# Altium schematic sheet mcu2.SchDoc
size A4
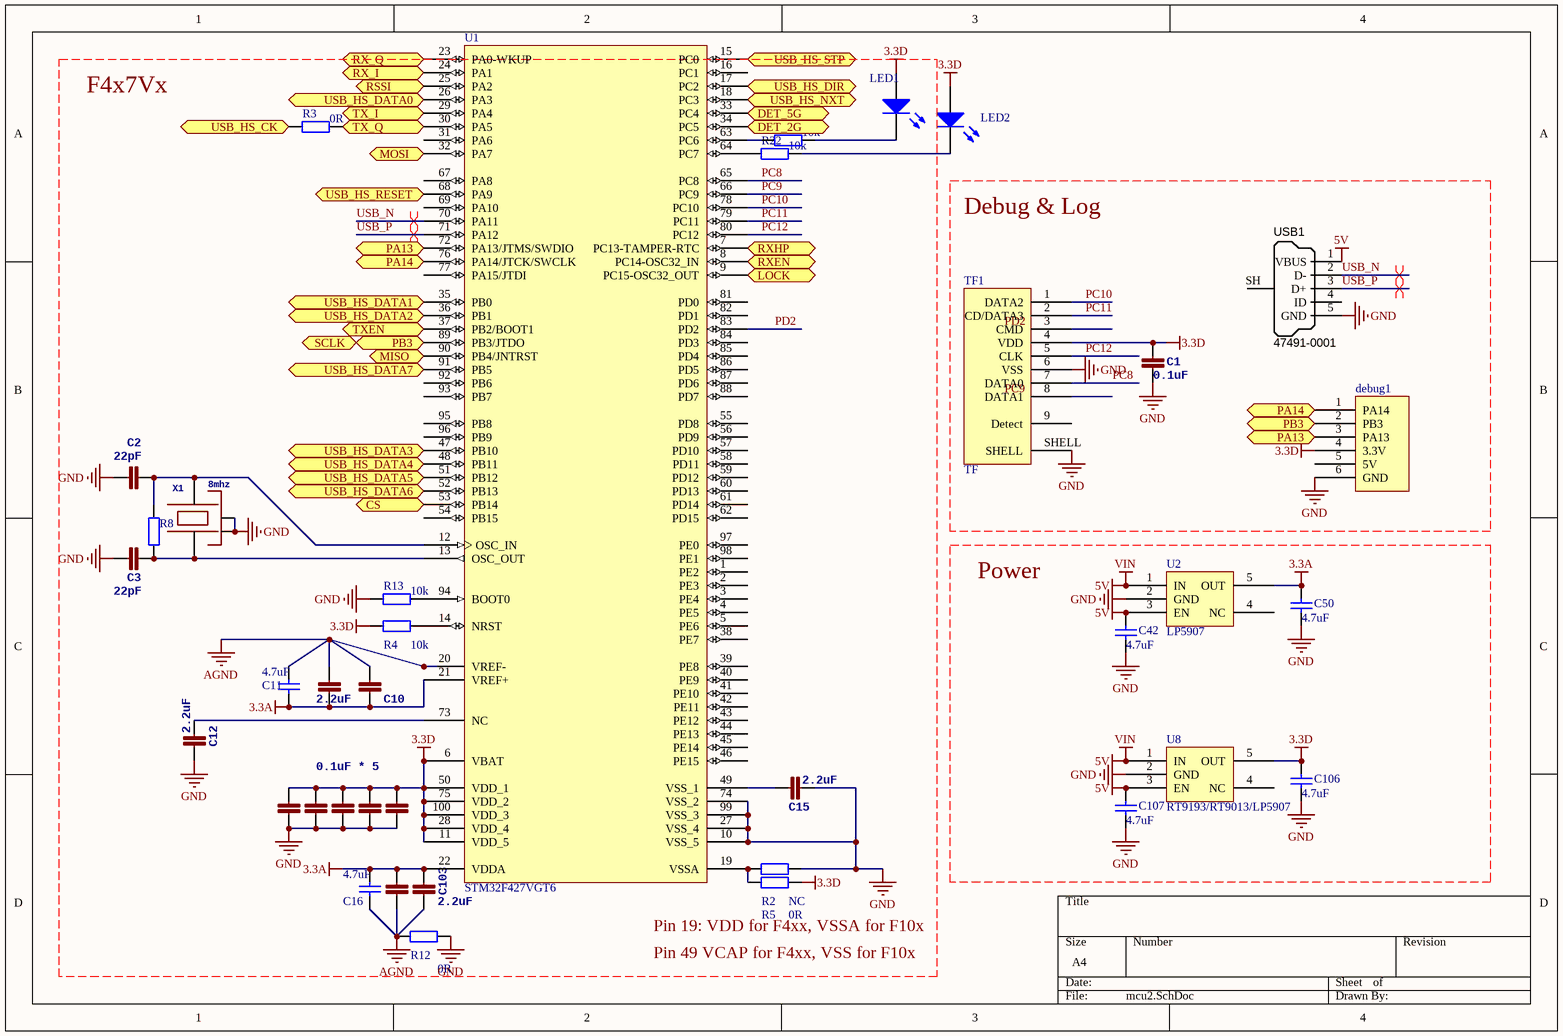
[diagram p0: mcu2.SchDoc]

## Parts
C1  0.1uF  [0402]
C2  22pF  [0402]
C3  22pF  [0402]
C4  0.1uF * 5  [0402]
C5  1n  [0402]  (value not drawn)
C6  1n  [0402]  (value not drawn)
C7  1n  [0402]  (value not drawn)
C10  2.2uF  [0603]
C11  4.7uF  [0805]
C12  2.2uF  [0603]
C13  1n  [0402]  (value not drawn)
C14  1n  [0402]  (value not drawn)
C15  2.2uF  [0603]
C16  4.7uF  [0805]
C42  4.7uF  [0603]
C50  4.7uF  [0603]
C102  1n  [0402]  (value not drawn)
C103  2.2uF  [0603]
C106  4.7uF  [0603]
C107  4.7uF  [0603]
debug1  debug  [WFRSM125]  (value not drawn)
LED1  LED0  [0603]  (value not drawn)
LED2  LED0  [0603]  (value not drawn)
R2  0R  [0402]
R3  0R  [0402]
R4  10k  [0402]
R5  NC  [0402]
R8  (no value)  [0402]
R12  0R  [0402]
R13  10k  [0402]
R21  10k  [0402]
R22  10k  [0402]
TF1  TF  [TF]
U1  STM32F427VGT6  [LQFP100_N]
U2  LP5907  [SOT23-5]
U8  RT9193/RT9013/LP5907  [SOT23-5]
USB1  Manufacturer Part Number 1: 47491-0001  [MICRO-YZX]  (hidden comment: USB Micro Type B)
X1  8mhz  [OSCILLATOR-3.2X2.5]

## Ports
CS, DET_2G, DET_5G, LOCK, MISO, MOSI, PA13, PA14, PB3, RSSI, RX_I, RX_Q, RXEN, RXHP, SCLK, TX_I, TX_Q, TXEN, USB_HS_CK, USB_HS_DATA0, USB_HS_DATA1, USB_HS_DATA2, USB_HS_DATA3, USB_HS_DATA4, USB_HS_DATA5, USB_HS_DATA6, USB_HS_DATA7, USB_HS_DIR, USB_HS_NXT, USB_HS_RESET, USB_HS_STP

## Nets
3.3A: C7.1 C10.1 C11.2 C16.1 C50.2 C102.2 C103.2 U1.21(VREF+) U1.22(VDDA) U2.5(OUT)
3.3D: C1.2 C4.2 C5.2 C6.2 C13.2 C14.2 C106.2 debug1.4(3.3V) LED1.1(A) LED2.1(A) R2.1 R4.2 TF1.4(VDD) U1.6(VBAT) U1.11(VDD_5) U1.28(VDD_4) U1.50(VDD_1) U1.75(VDD_2) U1.100(VDD_3) U8.5(OUT)
5V: C42.2 C107.2 U2.1(IN) U2.3(EN) U8.1(IN) U8.3(EN) USB1.1(VBUS)  [also labelled VIN]
AGND: C7.2 C10.2 C11.1 C16.2 C102.1 C103.1 R12.2 U1.20(VREF-)
GND: C1.1 C2.2 C3.2 C4.1 C5.1 C6.1 C12.1 C13.1 C14.1 C15.2 C42.1 C50.1 C106.1 C107.1 debug1.6(GND) R5.1 R12.1 R13.1 TF1.6(VSS) TF1.SHELL U1.10(VSS_5) U1.27(VSS_4) U1.74(VSS_2) U1.99(VSS_3) U2.2(GND) U8.2(GND) USB1.5(GND) X1.2(NC_2) X1.4(NC_4)
CS: U1.53(PB14) ; port CS
DET_2G: U1.34(PC5) ; port DET_2G
DET_5G: U1.33(PC4) ; port DET_5G
LOCK: U1.9(PC15-OSC32_OUT) ; port LOCK
MISO: U1.90(PB4/JNTRST) ; port MISO
MOSI: U1.32(PA7) ; port MOSI
PA13: debug1.3(PA13) U1.72(PA13/JTMS/SWDIO) ; port PA13
PA14: debug1.1(PA14) U1.76(PA14/JTCK/SWCLK) ; port PA14
PB3: debug1.2(PB3) U1.89(PB3/JTDO) ; port SCLK, port PB3
PC8: TF1.7(DATA0) U1.65(PC8)
PC9: U1.66(PC9)
PC10: TF1.1(DATA2) U1.78(PC10)
PC11: TF1.2(CD/DATA3) U1.79(PC11)
PC12: TF1.5(CLK) U1.80(PC12)
PD2: U1.83(PD2)
RSSI: U1.25(PA2) ; port RSSI
RX_I: U1.24(PA1) ; port RX_I
RX_Q: U1.23(PA0-WKUP) ; port RX_Q
RXEN: U1.8(PC14-OSC32_IN) ; port RXEN
RXHP: U1.7(PC13-TAMPER-RTC) ; port RXHP
TX_I: U1.29(PA4) ; port TX_I
TX_Q: R3.2 U1.30(PA5) ; port TX_Q
TXEN: U1.37(PB2/BOOT1) ; port TXEN
USB_HS_CK: R3.1 ; port USB_HS_CK
USB_HS_DATA0: U1.26(PA3) ; port USB_HS_DATA0
USB_HS_DATA1: U1.35(PB0) ; port USB_HS_DATA1
USB_HS_DATA2: U1.36(PB1) ; port USB_HS_DATA2
USB_HS_DATA3: U1.47(PB10) ; port USB_HS_DATA3
USB_HS_DATA4: U1.48(PB11) ; port USB_HS_DATA4
USB_HS_DATA5: U1.51(PB12) ; port USB_HS_DATA5
USB_HS_DATA6: U1.52(PB13) ; port USB_HS_DATA6
USB_HS_DATA7: U1.91(PB5) ; port USB_HS_DATA7
USB_HS_DIR: U1.17(PC2) ; port USB_HS_DIR
USB_HS_NXT: U1.18(PC3) ; port USB_HS_NXT
USB_HS_RESET: U1.68(PA9) ; port USB_HS_RESET
USB_HS_STP: U1.15(PC0) ; port USB_HS_STP
USB_N: U1.70(PA11) USB1.2(D-)
USB_P: U1.71(PA12) USB1.3(D+)
NetC2_1: C2.1 R8.2 U1.12(OSC_IN) X1.3
NetC3_1: C3.1 R8.1 U1.13(OSC_OUT) X1.1
NetC12_2: C12.2 U1.73(NC)
NetC15_1: C15.1 U1.49(VSS_1)
NetLED1_2: LED1.2(K) R21.2
NetLED2_2: LED2.2(K) R22.2
NetR2_2: R2.2 R5.2 U1.19(VSSA)
NetR4_1: R4.1 U1.14(NRST)
NetR13_2: R13.2 U1.94(BOOT0)
NetR21_1: R21.1 U1.63(PC6)
NetR22_1: R22.1 U1.64(PC7)

Not connected (* = marked no-connect by the designer): debug1 5(5V); TF1 3(CMD) 8(DATA1) 9(Detect); U1 1(PE2) 2(PE3) 3(PE4) 4(PE5) 5(PE6) 16(PC1) 31(PA6) 38(PE7) 39(PE8) 40(PE9) 41(PE10) 42(PE11) 43(PE12) 44(PE13) 45(PE14) 46(PE15) 54(PB15) 55(PD8) 56(PD9) 57(PD10) 58(PD11) 59(PD12) 60(PD13) 61(PD14) 62(PD15) 67(PA8) 69(PA10) 77(PA15/JTDI) 81(PD0) 82(PD1) 84(PD3) 85(PD4) 86(PD5) 87(PD6) 88(PD7) 92(PB6) 93(PB7) 95(PB8) 96(PB9) 97(PE0) 98(PE1); U2 4(NC); U8 4(NC); USB1 4(ID) SH(Shell)

## Layout directives
differential pair: USB_N, USB_P

## Notes on the sheet
- F4x7Vx
- Debug & Log
- Power
- Pin 19: VDD for F4xx, VSSA for F10x
- Pin 49 VCAP for F4xx, VSS for F10x
- Labels drawn without touching a wire or pin: PC9, PD2

## Library data of the parts
C1-C7 C10 C12-C15 C102 C103 = CAP0402-CAP: <b>Capacitor</b> / Standard 0603 ceramic capacitor, and 0.1" leaded capacitor.; PARTNO: CC0402ZRY5V7BB104
C11 C16 C42 C50 C106 C107 = Cap: Capacitor; Published: 8-Jun-2000; LatestRevisionDate: 17-Jul-2002; LatestRevisionNote: Re-released for DXP Platform.; PackageReference: RAD-0.3; Publisher: Altium Limited; PackageDescription: Radial Cap, Thru-Hole; 2 Leads; 0.3 in Pin Spacing
LED1 LED2 = LED0: Typical INFRARED GaAs LED; Published: 8-Jun-2000; LatestRevisionDate: 08-Jul-2005; LatestRevisionNote: Mech Layer 1 removed.; PackageReference: LED-0; Publisher: Altium Limited; PackageDescription: LED; 2 Leads
R2-R5 R8 R12 R13 R21 R22 = Res2: Resistor; Value: 0Ohm; Published: 8-Jun-2000; LatestRevisionDate: 17-Jul-2002; LatestRevisionNote: Re-released for DXP Platform.; PackageReference: AXIAL-0.4; Publisher: Altium Limited; PackageDescription: Axial Device, Thru-Hole; 2 Leads; 0.4 in Pin Spacing
U1 = STM32F103VBT6: STM32 ARM-based 32-bit MCU with 64 Kbytes Flash, 100-pin LQFP, Industrial Temperature; Published: *; DatasheetVersion: *; PackageVersion: *; PackageReference: *; Publisher: *; PackageDescription: *; ComponentLink1Description: *; ComponentLink1URL: *; ComponentLink2Description: *; ComponentLink2URL: *
U8 = LP5907
USB1 = USB_Micro_TypeB: Connector SMD USB Micro Type B middle mount; Manufacturer 1: Molex Inc; SCDType: undef; Package / Case: SMD; Supplier 1: Digi-Key; Supplier Part Number 1: WM17142CT-ND
X1 = OSCILLATOR-3.2X2.5: Crystal Oscillator in 3.2x2.5 SMD